# EasyEDA schematic BoardTMS320 全部排针引出版本.json
TITLE: Sheet_1; REV: 1.0; Date: 2022-05-20; Sheet: 1/1; Drawn By: MALossov; Company: Your Company
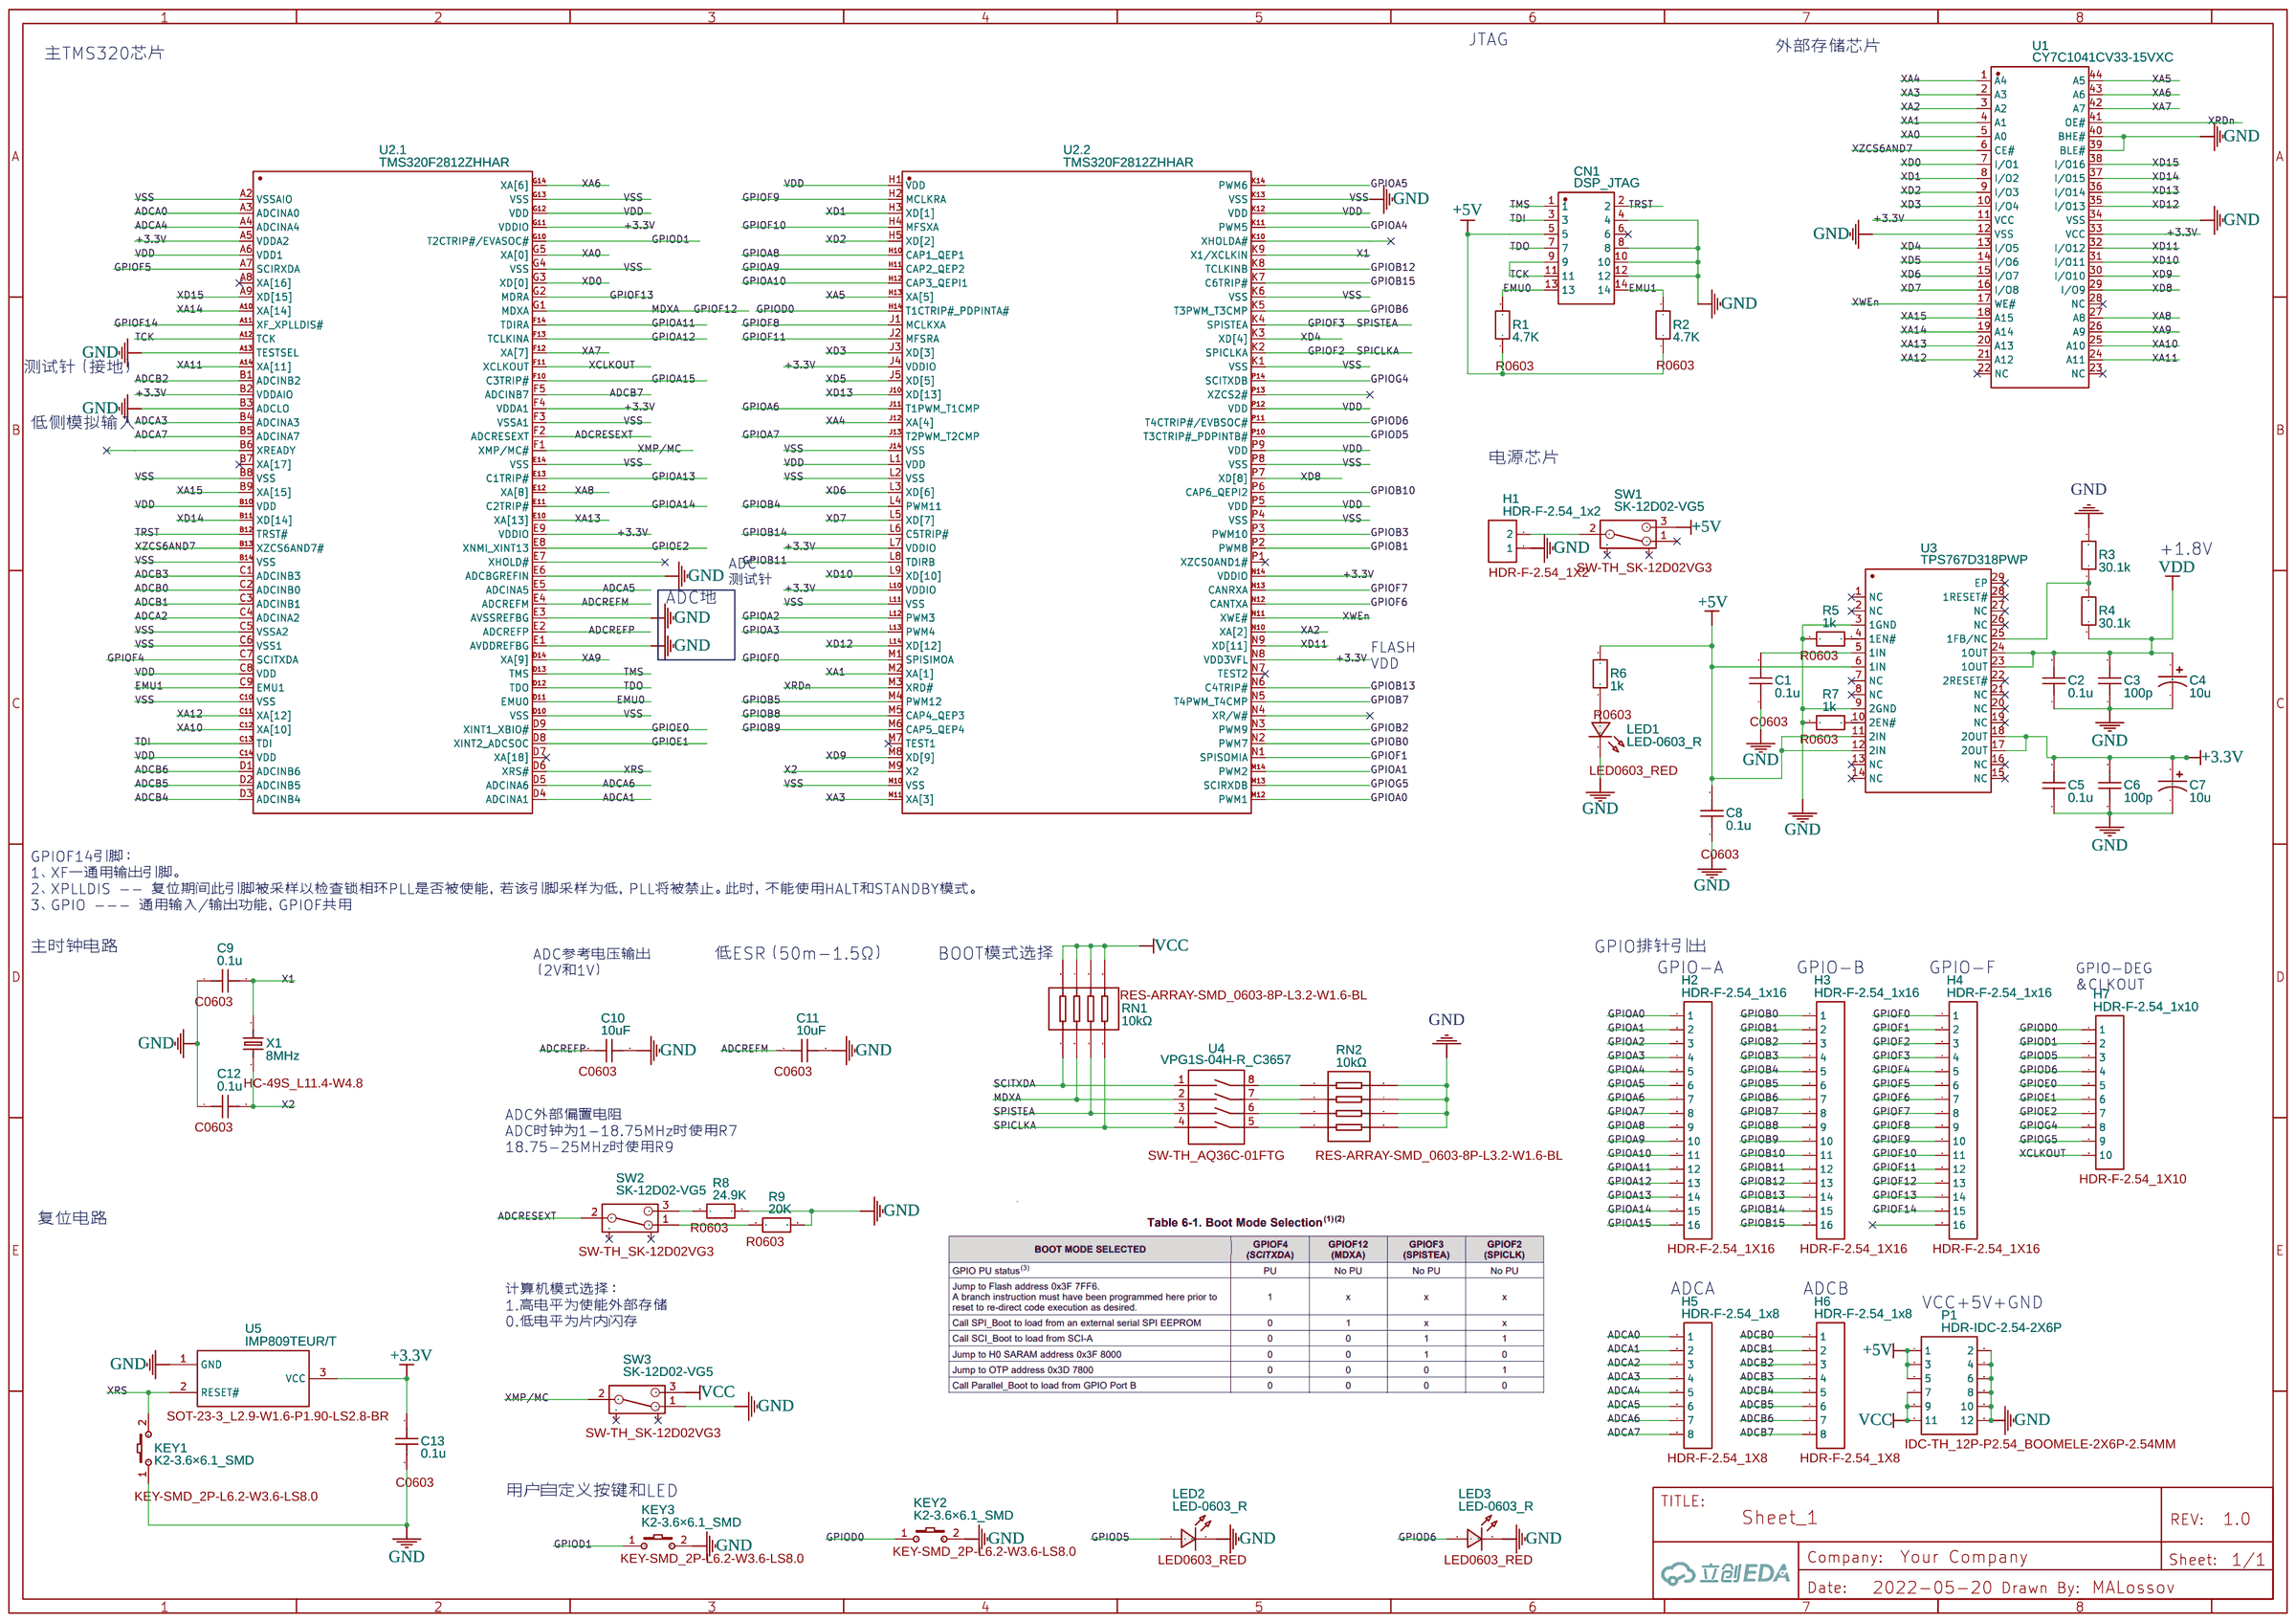
[diagram p0: schematic sheet]

## Parts
C1  0.1u  [C0603]
C2  0.1u  [C0603]
C3  100p  [C0603]
C4  10u  [CASE-A_3216]
C5  0.1u  [C0603]
C6  100p  [C0603]
C7  10u  [CASE-A_3216]
C8  0.1u  [C0603]
C9  0.1u  [C0603]
C10  10uF  [C0603]
C11  10uF  [C0603]
C12  0.1u  [C0603]
C13  0.1u  [C0603]
CN1  DSP_JTAG  [CONN-TH_L14.0-W4.0-P2.00_DSP_JTAG]
H1  HDR-F-2.54_1x2  [HDR-F-2.54_1X2]
H2  HDR-F-2.54_1x16  [HDR-F-2.54_1X16]
H3  HDR-F-2.54_1x16  [HDR-F-2.54_1X16]
H4  HDR-F-2.54_1x16  [HDR-F-2.54_1X16]
H5  HDR-F-2.54_1x8  [HDR-F-2.54_1X8]
H6  HDR-F-2.54_1x8  [HDR-F-2.54_1X8]
H7  HDR-F-2.54_1x10  [HDR-F-2.54_1X10]
KEY1  K2-3.6×6.1_SMD  [KEY-SMD_2P-L6.2-W3.6-LS8.0]
KEY2  K2-3.6×6.1_SMD  [KEY-SMD_2P-L6.2-W3.6-LS8.0]
KEY3  K2-3.6×6.1_SMD  [KEY-SMD_2P-L6.2-W3.6-LS8.0]
LED1  LED-0603_R  [LED0603_RED]
LED2  LED-0603_R  [LED0603_RED]
LED3  LED-0603_R  [LED0603_RED]
P1  HDR-IDC-2.54-2X6P  [IDC-TH_12P-P2.54_BOOMELE-2X6P-2.54MM]
R1  4.7K  [R0603]
R2  4.7K  [R0603]
R3  30.1k  [R0603]
R4  30.1k  [R0603]
R5  1k  [R0603]
R6  1k  [R0603]
R7  1k  [R0603]
R8  24.9K  [R0603]
R9  20K  [R0603]
RN1  10kΩ  [RES-ARRAY-SMD_0603-8P-L3.2-W1.6-BL]
RN2  10kΩ  [RES-ARRAY-SMD_0603-8P-L3.2-W1.6-BL]
SW1  SK-12D02-VG5  [SW-TH_SK-12D02VG3]
SW2  SK-12D02-VG5  [SW-TH_SK-12D02VG3]
SW3  SK-12D02-VG5  [SW-TH_SK-12D02VG3]
U1  CY7C1041CV33-15VXC  [SOJ-44_L28.6-W10.2-P1.27-LS11.2-BL]
U2  TMS320F2812ZHHAR  [LFBGA-179_L12.0-W12.0-P0.80-BL_TI_TMS320F2812ZHHAR]  (sections 1,2)
U3  TPS767D318PWP  [HTSSOP-28_L9.7-W4.4-P0.65-LS6.4-BL-EP]
U4  VPG1S-04H-R_C3657  [SW-TH_AQ36C-01FTG]
U5  IMP809TEUR/T  [SOT-23-3_L2.9-W1.6-P1.90-LS2.8-BR]
X1  8MHz  [HC-49S_L11.4-W4.8]

## Library data of the parts
C1 C8-C13 = C_0603_US: Contributor: LCEDA_Lib; Package Display: Yes
C2 C3 C5 C6 = C_0603_US: Contributor: LCEDA_Lib
C4 C7 = C_Tan_SMD_A_US: Contributor: LCEDA_Lib
CN1 = DSP_JTAG: Supplier: LCSC; Supplier Part: C9900001883; JLCPCB Part Class: Extended Part; Contributor: LCSC
H1 = HDR-F-2.54_1x2: Supplier Part: C49661; Supplier: LCSC; Contributor: LCEDA_Lib; Package Display: Yes
H2-H4 = HDR-F-2.54_1x16: Supplier Part: C66987; Supplier: LCSC; Contributor: LCEDA_Lib; Package Display: Yes
H5 H6 = HDR-F-2.54_1x8: Supplier Part: C225505; Supplier: LCSC; Contributor: LCEDA_Lib; Package Display: Yes
H7 = HDR-F-2.54_1x10: Supplier Part: C35445; Supplier: LCSC; Contributor: LCEDA_Lib; Package Display: Yes
KEY1-KEY3 = K2-3.6×6.1_SMD: Supplier Part: C118141; Supplier: LCSC; Manufacturer Part: K2-1107ST-A4SW-06; Contributor: LCEDA_Lib; 制造商: 韩国韩荣; Package Display: Yes
LED1-LED3 = LED-0603_R: Manufacturer: EVERLIGHT(台湾亿光); Manufacturer Part: 19-217/R6C-AL1M2VY/3T; Supplier Part: C72044; Supplier: LCSC; Contributor: LCEDA_01; Package Display: Yes
P1 = HDR-IDC-2.54-2X6P: Supplier: LCSC; Manufacturer: BOOMELE; Manufacturer Part: IDC Box 2X6 2.54MM; Supplier Part: C9136; Package Display: Yes
R1 R2 R5-R9 = R_0603_EU: Contributor: LCEDA_Lib; Package Display: Yes
R3 R4 = R_0603_EU: Contributor: LCEDA_Lib
RN1 RN2 = RC-ML08W103JT: Supplier: LCSC; Manufacturer: FH; Resistance (Ohms): 10K; Contributor: LCSC; Supplier Part: C69593; JLCPCB Part Class: Extended Part; Package Display: Yes
SW1-SW3 = SK-12D02-VG5: Supplier: LCSC; Supplier Part: C136722; Manufacturer: Rectangular Connectors - Contacts; Contributor: LCSC; Package Display: Yes
U1 = CY7C1041CV33-15VXC: Supplier: LCSC; Supplier Part: C1351734; Manufacturer: SPANSION(飞索); link: https://atta.szlcsc.comnull; Contributor: lcsc
U2 = TMS320F2812ZHHAR: Supplier: LCSC; Supplier Part: C702131; Manufacturer: TI(德州仪器); subpart_no: 1
U3 = TPS767D318PWP: Supplier: LCSC; Supplier Part: C2869255; Manufacturer: TI(德州仪器); link: https://atta.szlcsc.comnull; Contributor: LCSC
U4 = VPG1S-04H-R_C3657: Supplier Part: C3657; Supplier: LCSC; Manufacturer: ReliaPro; Manufacturer Part: VPG1S-04H-R; JLCPCB Part Class: Extended Part; Package Display: Yes
U5 = IMP809TEUR/T: Supplier: LCSC; Manufacturer: IMP; Supplier Part: C7895; JLCPCB Part Class: Extended Part; Package Display: Yes
X1 = XJHCCLNAND-8M: Supplier: LCSC; Manufacturer: TAITIEN; Contributor: LCSC; Supplier Part: C123298; JLCPCB Part Class: Extended Part; Package Display: Yes

## Nets
+3.3V: C5.2 C6.2 C7.1 C13.1 U1.11(VCC) U1.33(VCC) U2.A5(VDDA2) U2.B2(VDDAIO) U2.E9(VDDIO) U2.F4(VDDA1) U2.G11(VDDIO) U2.J4(VDDIO) U2.L7(VDDIO) U2.L10(VDDIO) U2.N8(VDD3VFL) U2.N14(VDDIO) U3.17(2OUT) U3.18(2OUT) U5.3(VCC)
+5V: C8.2 CN1.5 P1.1 P1.3 P1.5 R1.1 R2.1 R6.2 SW1.3 U3.6(1IN) U3.11(2IN) U3.12(2IN)
GND: C1.1 C2.1 C3.1 C4.2 C5.1 C6.1 C7.2 C8.1 C9.1 C10.2 C11.2 C12.1 C13.2 CN1.4 CN1.8 CN1.10 CN1.12 H1.1 KEY1.1 KEY2.2 KEY3.2 LED1.2 LED2.2 LED3.2 P1.2 P1.4 P1.6 P1.8 P1.10 P1.12 R3.2 R5.1 R7.1 R8.2 R9.2 RN2.5 RN2.6 RN2.7 RN2.8 SW3.1 U1.12(VSS) U1.34(VSS) U1.39(BLE#) U1.40(BHE#) U2.A2(VSSAIO) U2.A13(TESTSEL) U2.B3(ADCLO) U2.B8(VSS) U2.B14(VSS) U2.C5(VSSA2) U2.C6(VSS1) U2.C10(VSS) U2.D10(VSS) U2.E1(AVDDREFBG) U2.E3(AVSSREFBG) U2.E6(ADCBGREFIN) U2.E14(VSS) U2.F3(VSSA1) U2.G4(VSS) U2.G13(VSS) U2.J14(VSS) U2.K1(VSS) U2.K6(VSS) U2.K13(VSS) U2.L2(VSS) U2.L11(VSS) U2.M10(VSS) U2.P4(VSS) U2.P8(VSS) U3.3(1GND) U3.9(2GND) U5.1(GND)
VCC: P1.7 P1.9 P1.11 RN1.5 RN1.6 RN1.7 RN1.8 SW3.3
VDD: C2.2 C3.2 C4.1 R4.1 U2.A6(VDD1) U2.B10(VDD) U2.C8(VDD) U2.C14(VDD) U2.G12(VDD) U2.H1(VDD) U2.K12(VDD) U2.L1(VDD) U2.P5(VDD) U2.P9(VDD) U2.P12(VDD) U3.23(1OUT) U3.24(1OUT)
ADCA0: H5.1 U2.A3(ADCINA0)
ADCA1: H5.2 U2.D4(ADCINA1)
ADCA2: H5.3 U2.C4(ADCINA2)
ADCA3: H5.4 U2.B4(ADCINA3)
ADCA4: H5.5 U2.A4(ADCINA4)
ADCA5: H5.6 U2.E5(ADCINA5)
ADCA6: H5.7 U2.D5(ADCINA6)
ADCA7: H5.8 U2.B5(ADCINA7)
ADCB0: H6.1 U2.C2(ADCINB0)
ADCB1: H6.2 U2.C3(ADCINB1)
ADCB2: H6.3 U2.B1(ADCINB2)
ADCB3: H6.4 U2.C1(ADCINB3)
ADCB4: H6.5 U2.D3(ADCINB4)
ADCB5: H6.6 U2.D2(ADCINB5)
ADCB6: H6.7 U2.D1(ADCINB6)
ADCB7: H6.8 U2.F5(ADCINB7)
ADCREFM: C11.1 U2.E4(ADCREFM)
ADCREFP: C10.1 U2.E2(ADCREFP)
ADCRESEXT: SW2.2 U2.F2(ADCRESEXT)
EMU0: CN1.13 R1.2 U2.D11(EMU0)
EMU1: CN1.14 R2.2 U2.C9(EMU1)
GPIOA0: H2.1 U2.M12(PWM1)
GPIOA1: H2.2 U2.M14(PWM2)
GPIOA2: H2.3 U2.L12(PWM3)
GPIOA3: H2.4 U2.L13(PWM4)
GPIOA4: H2.5 U2.K11(PWM5)
GPIOA5: H2.6 U2.K14(PWM6)
GPIOA6: H2.7 U2.J11(T1PWM_T1CMP)
GPIOA7: H2.8 U2.J13(T2PWM_T2CMP)
GPIOA8: H2.9 U2.H10(CAP1_QEP1)
GPIOA9: H2.10 U2.H11(CAP2_QEP2)
GPIOA10: H2.11 U2.H12(CAP3_QEPI1)
GPIOA11: H2.12 U2.F14(TDIRA)
GPIOA12: H2.13 U2.F13(TCLKINA)
GPIOA13: H2.14 U2.E13(C1TRIP#)
GPIOA14: H2.15 U2.E11(C2TRIP#)
GPIOA15: H2.16 U2.F10(C3TRIP#)
GPIOB0: H3.1 U2.N2(PWM7)
GPIOB1: H3.2 U2.P2(PWM8)
GPIOB2: H3.3 U2.N3(PWM9)
GPIOB3: H3.4 U2.P3(PWM10)
GPIOB4: H3.5 U2.L4(PWM11)
GPIOB5: H3.6 U2.M4(PWM12)
GPIOB6: H3.7 U2.K5(T3PWM_T3CMP)
GPIOB7: H3.8 U2.N5(T4PWM_T4CMP)
GPIOB8: H3.9 U2.M5(CAP4_QEP3)
GPIOB9: H3.10 U2.M6(CAP5_QEP4)
GPIOB10: H3.11 U2.P6(CAP6_QEPI2)
GPIOB11: H3.12 U2.L8(TDIRB)
GPIOB12: H3.13 U2.K8(TCLKINB)
GPIOB13: H3.14 U2.N6(C4TRIP#)
GPIOB14: H3.15 U2.L6(C5TRIP#)
GPIOB15: H3.16 U2.K7(C6TRIP#)
GPIOD0: H7.1 KEY2.1 U2.H14(T1CTRIP#_PDPINTA#)
GPIOD1: H7.2 KEY3.1 U2.G10(T2CTRIP#/EVASOC#)
GPIOD5: H7.3 LED2.1 U2.P10(T3CTRIP#_PDPINTB#)
GPIOD6: H7.4 LED3.1 U2.P11(T4CTRIP#/EVBSOC#)
GPIOE0: H7.5 U2.D9(XINT1_XBIO#)
GPIOE1: H7.6 U2.D8(XINT2_ADCSOC)
GPIOE2: H7.7 U2.E8(XNMI_XINT13)
GPIOF0: H4.1 U2.M1(SPISIMOA)
GPIOF1: H4.2 U2.N1(SPISOMIA)
GPIOF2: H4.3 RN1.4 U2.K2(SPICLKA) U4.4
GPIOF3: H4.4 RN1.3 U2.K4(SPISTEA) U4.3
GPIOF4: H4.5 U2.C7(SCITXDA)
GPIOF5: H4.6 U2.A7(SCIRXDA)
GPIOF6: H4.7 U2.N12(CANTXA)
GPIOF7: H4.8 U2.N13(CANRXA)
GPIOF8: H4.9 U2.J1(MCLKXA)
GPIOF9: H4.10 U2.H2(MCLKRA)
GPIOF10: H4.11 U2.H4(MFSXA)
GPIOF11: H4.12 U2.J2(MFSRA)
GPIOF12: H4.13 RN1.2 U2.G1(MDXA) U4.2
GPIOF13: H4.14 U2.G2(MDRA)
GPIOF14: H4.15 U2.A11(XF_XPLLDIS#)
GPIOG4: H7.8 U2.P14(SCITXDB)
GPIOG5: H7.9 U2.M13(SCIRXDB)
SCITXDA: RN1.1 U4.1
TCK: CN1.9 CN1.11 U2.A12(TCK)
TDI: CN1.3 U2.C13(TDI)
TDO: CN1.7 U2.D12(TDO)
TMS: CN1.1 U2.D13(TMS)
TRST: CN1.2 U2.B12(TRST#)
X1: C9.2 U2.K9(X1/XCLKIN) X1.2
X2: C12.2 U2.M9(X2) X1.1
XA0: U1.5(A0) U2.G5(XA[0])
XA1: U1.4(A1) U2.M2(XA[1])
XA2: U1.3(A2) U2.N10(XA[2])
XA3: U1.2(A3) U2.M11(XA[3])
XA4: U1.1(A4) U2.J12(XA[4])
XA5: U1.44(A5) U2.H13(XA[5])
XA6: U1.43(A6) U2.G14(XA[6])
XA7: U1.42(A7) U2.F12(XA[7])
XA8: U1.27(A8) U2.E12(XA[8])
XA9: U1.26(A9) U2.D14(XA[9])
XA10: U1.25(A10) U2.C12(XA[10])
XA11: U1.24(A11) U2.A14(XA[11])
XA12: U1.21(A12) U2.C11(XA[12])
XA13: U1.20(A13) U2.E10(XA[13])
XA14: U1.19(A14) U2.A10(XA[14])
XA15: U1.18(A15) U2.B9(XA[15])
XCLKOUT: H7.10 U2.F11(XCLKOUT)
XD0: U1.7(I/O1) U2.G3(XD[0])
XD1: U1.8(I/O2) U2.H3(XD[1])
XD2: U1.9(I/O3) U2.H5(XD[2])
XD3: U1.10(I/O4) U2.J3(XD[3])
XD4: U1.13(I/O5) U2.K3(XD[4])
XD5: U1.14(I/O6) U2.J5(XD[5])
XD6: U1.15(I/O7) U2.L3(XD[6])
XD7: U1.16(I/O8) U2.L5(XD[7])
XD8: U1.29(I/O9) U2.P7(XD[8])
XD9: U1.30(I/O10) U2.M8(XD[9])
XD10: U1.31(I/O11) U2.L9(XD[10])
XD11: U1.32(I/O12) U2.N9(XD[11])
XD12: U1.35(I/O13) U2.L14(XD[12])
XD13: U1.36(I/O14) U2.J10(XD[13])
XD14: U1.37(I/O15) U2.B11(XD[14])
XD15: U1.38(I/O16) U2.A9(XD[15])
XMP/MC: SW3.2 U2.F1(XMP/MC#)
XRDn: U1.41(OE#) U2.M3(XRD#)
XRS: KEY1.2 U2.D6(XRS#) U5.2(RESET#)
XWEn: U1.17(WE#) U2.N11(XWE#)
XZCS6AND7: U1.6(CE#) U2.B13(XZCS6AND7#)
Net-(C1-2): C1.2 U3.5(1IN)
Net-(H1-2): H1.2 SW1.2
Net-(LED1-1): LED1.1 R6.1
Net-(R3-1): R3.1 R4.2 U3.25(1FB/NC)
Net-(R5-2): R5.2 U3.4(1EN#)
Net-(R7-2): R7.2 U3.10(2EN#)
Net-(R8-1): R8.1 SW2.3
Net-(R9-1): R9.1 SW2.1
Net-(RN2-1): RN2.1 U4.8
Net-(RN2-2): RN2.2 U4.7
Net-(RN2-3): RN2.3 U4.6
Net-(RN2-4): RN2.4 U4.5

Not connected (* = marked no-connect by the designer): CN1 6*; H4 16; SW1 1* 4* 5*; SW2 4* 5*; SW3 4* 5*; U1 22(NC)* 23(NC)* 28(NC)*; U2 A8(XA[16])* B6(XREADY) B7(XA[17])* D7(XA[18])* E7(XHOLD#) K10(XHOLDA#) M7(TEST1)* N4(XR/W#) N7(TEST2)* P1(XZCS0AND1#)* P13(XZCS2#); U3 1(NC)* 2(NC)* 7(NC)* 8(NC)* 13(NC)* 14(NC)* 15(NC)* 16(NC)* 19(NC)* 20(NC)* 21(NC)* 22(2RESET#)* 26(NC)* 27(NC)* 28(1RESET#)* 29(EP)*

## Notes on the sheet
- JTAG
- 主TMS320芯片
- 外部存储芯片
- 测试针（接地）
- 低侧模拟输入
- 电源芯片
- +1.8V
- ADC
  测试针
- ADC地
- FLASH
  VDD
- GPIOF14引脚：
  1、XF一通用输出引脚。
  2、XPLLDIS -- 复位期间此引脚被采样以检查锁相环PLL是否被使能，若该引脚采样为低，PLL将被禁止。此时，不能使用HALT和STANDBY模式。
  3、GPIO --- 通用输入/输出功能，GPIOF共用
- 主时钟电路
- GPIO排针引出
- ADC参考电压输出
  （2V和1V）
- 低ESR（50m-1.5Ω）
- BOOT模式选择
- GPIO-A
- GPIO-B
- GPIO-F
- GPIO-DEG
  &CLKOUT
- ADC外部偏置电阻
  ADC时钟为1-18.75MHz时使用R7
  18.75-25MHz时使用R9
- 复位电路
- 计算机模式选择：
  1.高电平为使能外部存储
  0.低电平为片内闪存
- ADCA
- ADCB
- VCC+5V+GND
- 用户自定义按键和LED
